# Altium schematic sheet Power.SchDoc
size A4; CheckedBy: Sr. Andrés Roldán; Address1: Avda. Madrid 28, Edif. I+D Josefina Castro Vizoso,  2ª planta 18012 - GRANADA, SPAIN; SheetNumber: 5; SheetTotal: 6
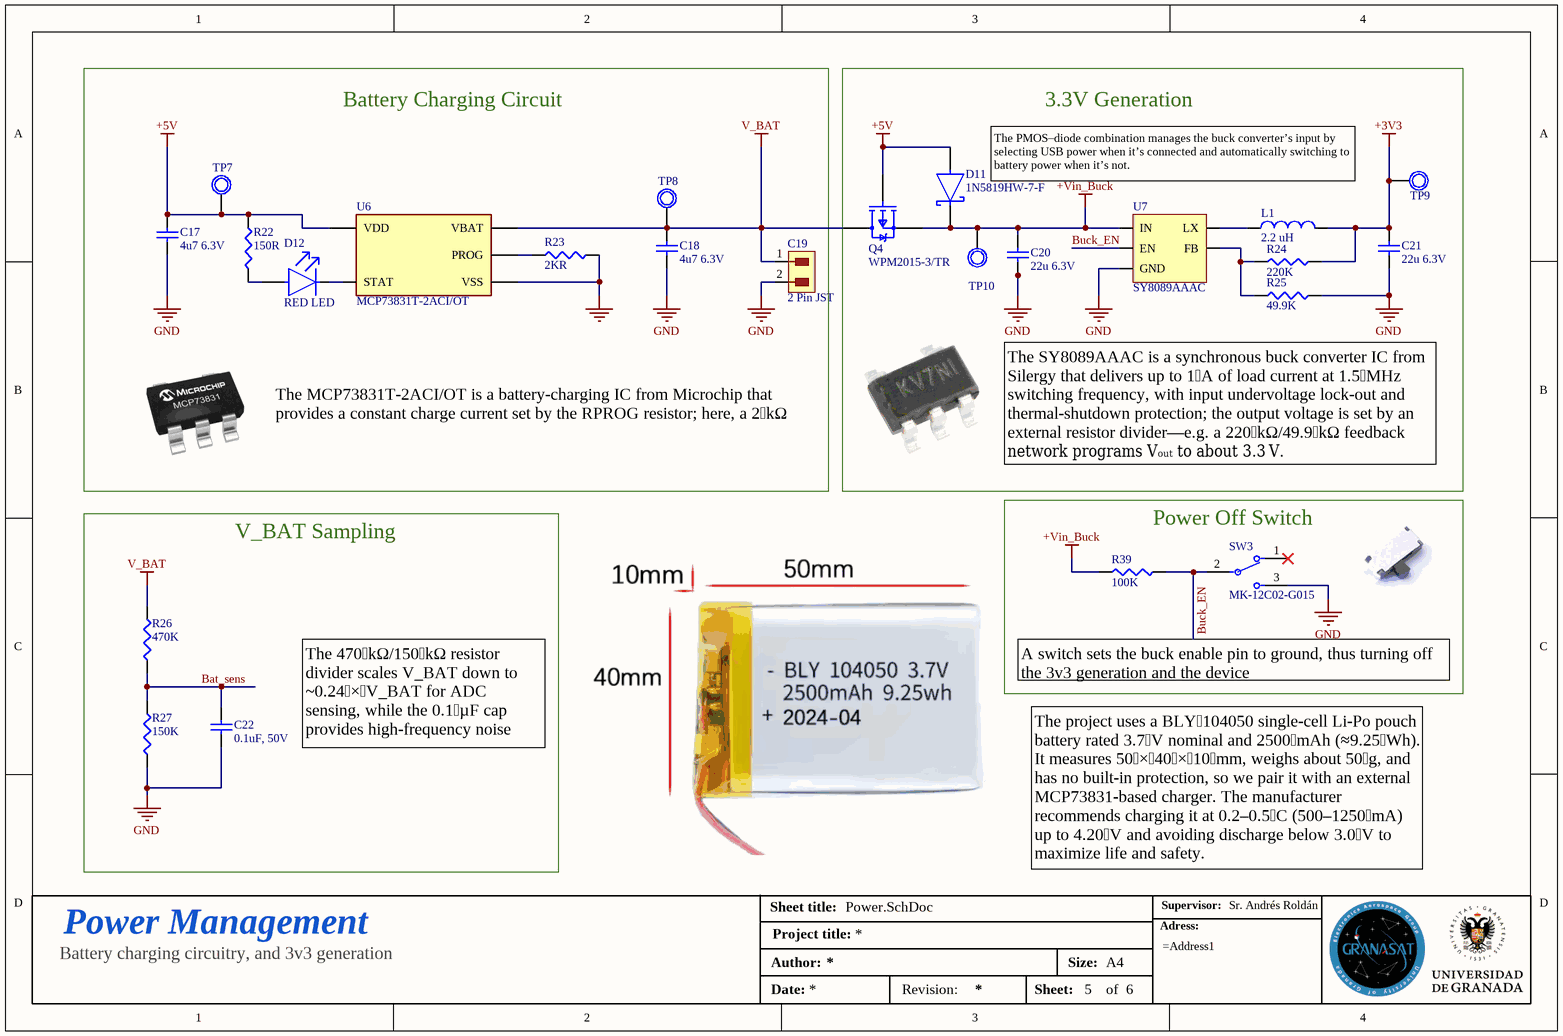
[diagram p0: Power.SchDoc]

## Parts
C17  4u7 6.3V  [CAP 0402_1005]
C18  4u7 6.3V  [CAP 0402_1005]
C19  2 Pin JST  [JST_B2B-PH-K-S]
C20  22u 6.3V  [CAPC1608X90]
C21  22u 6.3V  [CAPC1608X90]
C22  0.1uF, 50V  [CAP 0402_1005]
D11  1N5819HW-7-F  [FP-SOD123-MFG]
D12  RED LED  [FP-LTST-C171KGKT-MFG]
L1  2.2 uH  [IND_VLS3015ET-220M-CA]
Q4  WPM2015-3/TR  [SOT-23]
R22  150R  [RESC1005X37N]
R23  2KR  [RESC1005X37N]
R24  220K  [RESC1005X37N]
R25  49.9K  [RESC1005X37N]
R26  470K  [RESC1005X37N]
R27  150K  [RESC1005X37N]
R39  100K  [RESC1005X37N]
SW3  MK-12C02-G015  [Switch]
TP7  Testpoint  [Testpoint]  (value not drawn)  (no BOM)
TP8  Testpoint  [Testpoint]  (value not drawn)  (no BOM)
TP9  Testpoint  [Testpoint]  (value not drawn)  (no BOM)
TP10  Testpoint  [Testpoint]  (value not drawn)  (no BOM)
U6  MCP73831T-2ACI/OT  [FP-C04-091-OT-IPC_B]
U7  SY8089AAAC  [SOT95P285X140-5N]

## Blocks framed on the sheet
Battery Charging Circuit: C17-C19 D12 R22 R23 TP7 TP8 U6
3.3V Generation: C20 C21 D11 L1 Q4 R24 R25 TP9 TP10 U7
V_BAT Sampling: C22 R26 R27
Power Off Switch: R39 SW3

## Nets
+3V3: C21.2 L1.2 R24.2 TP9.1
+5V: C17.2 D11.2(A) Q4.1(G) R22.2 TP7.1 U6.4(VDD)
+Vin_Buck: C20.2 D11.1(C) Q4.2(S) R39.1 TP10.1 U7.4(IN)
GND: C17.1 C18.1 C19.2 C20.1 C21.1 C22.1 R23.2 R25.2 R27.2 SW3.3 U6.2(VSS) U7.2(GND)
V_BAT: C18.2 C19.1 Q4.3(D) R26.2 TP8.1 U6.3(VBAT)
Bat_sens: C22.2 R26.1 R27.1
Buck_EN: R39.2 SW3.2(C) U7.1(EN)
NetD12_1: D12.1(C) U6.1(STAT)
NetD12_2: D12.2(A) R22.1
NetL1_1: L1.1 U7.3(LX)
NetR23_1: R23.1 U6.5(PROG)
NetR24_1: R24.1 R25.1 U7.5(FB)

Not connected (* = marked no-connect by the designer): SW3 1*

## Notes on the sheet
- The PMOS–diode combination manages the buck converter’s input by selecting USB power when it’s connected and automatically switching to battery power when it’s not.
- The MCP73831T‑2ACI/OT is a battery‑charging IC from Microchip that provides a constant charge current set by the RPROG resistor; here, a 2 kΩ resistor programs the charging current to 500 mA.
- The SY8089AAAC is a synchronous buck converter IC from Silergy that delivers up to 1 A of load current at 1.5 MHz switching frequency, with input undervoltage lock‑out and thermal‑shutdown protection; the output voltage is set by an external resistor divider—e.g. a 220 kΩ/49.9 kΩ feedback network programs Vₒᵤₜ to about 3.3 V.
- A switch sets the buck enable pin to ground, thus turning off the 3v3 generation and the device
- The 470 kΩ/150 kΩ resistor divider scales V_BAT down to ~0.24 × V_BAT for ADC sensing, while the 0.1 µF cap provides high‑frequency noise filtering.
- Sheet title:
- The project uses a BLY 104050 single‑cell Li‑Po pouch battery rated 3.7 V nominal and 2500 mAh (≈9.25 Wh). It measures 50 × 40 × 10 mm, weighs about 50 g, and has no built‑in protection, so we pair it with an external MCP73831‑based charger. The manufacturer recommends charging it at 0.2–0.5 C (500–1250 mA) up to 4.20 V and avoiding discharge below 3.0 V to maximize life and safety.
- Supervisor:
- Power Management
- Author:
- Project title:
- Size:
- A4
- Adress:
- Battery charging circuitry, and 3v3 generation
- Date:
- Revision:
- Sheet:
- of

## Library data of the parts
C17 C18 = CL05A475KQ5NRNC: CAP CER 4.7UF 6.3V X5R 0402; Manufacturer: Samsung; Dielectric Material: Ceramic; Multilayer: Yes; Tolerance  (fill in as +-): 10%; Supplier: Digikey; Supplier Part Number: 1276-1481-1-ND; Manufacturer Part Number: CL05A475KQ5NRNC; RoHS: Yes; Category: Ceramic Capacitors; Stock: 1369367; Pricing: 1=0,08, 10=0,023, 100=0,016, 1000=0,0112, 2500=0,0096 (USD); Mounting Technology: Surface Mount; Pins: 2; Package Shape: Rectangular; Case/Package: 0402; Terminal Finish: Nickel; Min Operating Temperature: -55°C; Max Operating Temperature: 85°C; JESD-609 Code: e3; Value: 4.7uF; Capacitor Type: Ceramic; Packaging: Tape and Reel; Tolerance (fill in as +-): 10%; Rated DC Voltage (URdc): 6.3V; Temperature Characteristics Code: X5R; Termination: Wraparound; Reach SVHC Compliant: Yes; RoHS Compliant: Yes; ComponentLink1URL: https://datasheet.ciiva.com:443/pdfs/VipMasterIC/IC/SEMS/SEMS-S-A0008521219/SEMS-S-A0008521124-1.pdf?src-supplier=IHS+Markit; ComponentLink1Description: https://datasheet.ciiva.com:443/pdfs/VipMasterIC/IC/SEMS/SEMS-S-A0008521219/SEMS-S-A0008521124-1.pdf?src-supplier=IHS+Markit; ComponentLink2URL: https://datasheet.ciiva.com/25793/cl05a475kq5nrnc-25793634.pdf?src-supplier=Digikey; ComponentLink2Description: https://datasheet.ciiva.com/25793/cl05a475kq5nrnc-25793634.pdf?src-supplier=Digikey; LCSC Part Number: C2932473
C19 = B2B-PH-K-S(LF)(SN): Board Connector, 2 Contact(s), 1 Row(s), Male, Straight, 0.079 inch Pitch, Solder Terminal, Locking, Natural Insulator; Supplier: Farnell; Supplier Part Number: 9491856; Manufacturer: JST; Manufacturer Part Number: B2B-PH-K-S(LF)(SN); RoHS: Yes; Category: Headers and Wire Housings; Stock: 746862; Pricing: 100=0,0919, 1000=0,0724, 2500=0,0686, 5000=0,0647, 10000=0,0615, 20000=0,0603 (EUR); ComponentLink1URL: https://datasheet.ciiva.com:443/pdfs/VipMasterIC/IC/JSTM/JSTM-S-A0007943211/JSTM-S-A0007943211-1.pdf?src-supplier=IHS+Markit; ComponentLink1Description: https://datasheet.ciiva.com:443/pdfs/VipMasterIC/IC/JSTM/JSTM-S-A0007943211/JSTM-S-A0007943211-1.pdf?src-supplier=IHS+Markit; ComponentLink2URL: https://datasheet.ciiva.com/11746/0900766b8082f551-11746676.pdf?src-supplier=Rs; ComponentLink2Description: https://datasheet.ciiva.com/11746/0900766b8082f551-11746676.pdf?src-supplier=Rs; ComponentLink3URL: https://datasheet.ciiva.com/16422/b2b-ph-k-slfsn-16422715.pdf?src-supplier=Future+Electronics; ComponentLink3Description: https://datasheet.ciiva.com/16422/b2b-ph-k-slfsn-16422715.pdf?src-supplier=Future+Electronics; LCSC Part Number: C131337
C20 C21 = CL10A226MQ8NRNC: CAP CER 22UF 6.3V X5R 0603; Manufacturer: Samsung; Dielectric Material: Ceramic; Multilayer: Yes; Tolerance  (fill in as +-): 20%; Supplier: Digikey; Supplier Part Number: 1276-1193-1-ND; Manufacturer Part Number: CL10A226MQ8NRNC; RoHS: Yes; Category: Ceramic Capacitors; Stock: 1672290; Pricing: 1=0,22, 10=0,126, 50=0,0812, 100=0,0551, 500=0,0515, 1000=0,04061 (USD); Mounting Technology: Surface Mount; Pins: 2; Package Shape: Rectangular; Case/Package: 0603; Terminal Finish: Nickel; Min Operating Temperature: -55°C; Max Operating Temperature: 85°C; Termination: Wraparound; JESD-609 Code: e3; Value: 22uF; Capacitor Type: Ceramic; Package Style: SMTMeter; Packaging: Tape and Reel; Tolerance (fill in as +-): 20%; Rated DC Voltage (URdc): 6.3V; Temperature Characteristics Code: X5R; Length: 1.6mm; Width: 0.8mm; Height: 1mm; Reach SVHC Compliant: Yes; RoHS Compliant: Yes; ComponentLink1URL: https://datasheet.ciiva.com:443/pdfs/VipMasterIC/IC/SEMS/SEMS-S-A0008525088/SEMS-S-A0008525204-1.pdf?src-supplier=IHS+Markit; ComponentLink1Description: https://datasheet.ciiva.com:443/pdfs/VipMasterIC/IC/SEMS/SEMS-S-A0008525088/SEMS-S-A0008525204-1.pdf?src-supplier=IHS+Markit; ComponentLink2URL: https://datasheet.ciiva.com/25790/cl10a226mq8nrnc-25790695.pdf?src-supplier=Digikey; ComponentLink2Description: https://datasheet.ciiva.com/25790/cl10a226mq8nrnc-25790695.pdf?src-supplier=Digikey; ComponentLink3URL: https://datasheet.ciiva.com/26838/getdatasheetpartid-353311-26838372.pdf?src-supplier=Verical; ComponentLink3Description: https://datasheet.ciiva.com/26838/getdatasheetpartid-353311-26838372.pdf?src-supplier=Verical; ComponentLink4URL: https://datasheet.ciiva.com/29198/457121-da-01-en-vs-kondensator-0603-29198747.pdf?src-supplier=Conrad; ComponentLink4Description: https://datasheet.ciiva.com/29198/457121-da-01-en-vs-kondensator-0603-29198747.pdf?src-supplier=Conrad; ComponentLink5URL: https://datasheet.ciiva.com/16437/cl05b104kq5nnnc-16437317.pdf?src-supplier=Future+Electronics; ComponentLink5Description: https://datasheet.ciiva.com/16437/cl05b104kq5nnnc-16437317.pdf?src-supplier=Future+Electronics; LCSC Part Number: C59461
C22 = CL05B104KB5NNNC: CAP CER 0.1UF 50V X7R 0402; Manufacturer: Samsung; Dielectric Material: Ceramic; Value: 100nF; Multilayer: Yes; Tolerance  (fill in as +-): 10%; Supplier: Avnet; Supplier Part Number: CL05B104KB5NNNC; Manufacturer Part Number: CL05B104KB5NNNC; RoHS: Yes; Category: Ceramic Capacitors; Pricing: 100000=0,00598, 120000=0,00595, 220000=0,00592, 500000=0,00589, 1000000=0,00586 (USD); Mounting Technology: Surface Mount; Pins: 2; Package Shape: Rectangular; Case/Package: 0402; Terminal Finish: Nickel; Min Operating Temperature: -55°C; Max Operating Temperature: 125°C; JESD-609 Code: e3; Capacitor Type: Ceramic; Packaging: Tape and Reel; Tolerance (fill in as +-): 10%; Rated DC Voltage (URdc): 50V; Temperature Characteristics Code: X7R; Termination: Wraparound; Reach SVHC Compliant: Yes; RoHS Compliant: Yes; ComponentLink1URL: https://datasheet.ciiva.com:443/pdfs/VipMasterIC/IC/SEMS/SEMS-S-A0008523115/SEMS-S-A0008523176-1.pdf?src-supplier=IHS+Markit; ComponentLink1Description: https://datasheet.ciiva.com:443/pdfs/VipMasterIC/IC/SEMS/SEMS-S-A0008523115/SEMS-S-A0008523176-1.pdf?src-supplier=IHS+Markit; ComponentLink2URL: https://datasheet.octopart.com/CL05B104KB5NNNC-Samsung-datasheet-97040617.pdf?src-supplier=Future+Electronics; ComponentLink2Description: https://datasheet.octopart.com/CL05B104KB5NNNC-Samsung-datasheet-97040617.pdf?src-supplier=Future+Electronics; ComponentLink3URL: https://datasheet.octopart.com/CL05B104KB5NNNC-Samsung-datasheet-8326407.pdf?src-supplier=TME; ComponentLink3Description: https://datasheet.octopart.com/CL05B104KB5NNNC-Samsung-datasheet-8326407.pdf?src-supplier=TME; LCSC Part Number: C960916
D11 = 1N5819HW-7-F: DIODE SCHOTTKY 40V 1A SOD123; Manufacturer: Diodes; Diode Element Material: SILICON; Package Body Material: Plastic; Diode Type: RECTIFIER; Number of Elements: 1; Max Power Dissipation: 450mW; Forward Voltage: 320mV; Non-rep Pk Forward Current-Max: 25A; Time @ Peak Reflow Temperature-Max (s): 40s; Qualification Status: Not Qualified; Supplier: Digikey; Supplier Part Number: 1N5819HW-FDICT-ND; Manufacturer Part Number: 1N5819HW-7-F; RoHS: Yes; Category: Schottky Diodes; Stock: 462387; Pricing: 1=0,25, 10=0,17, 100=0,1207, 500=0,10056, 1000=0,09006 (USD); Pins: 2; Package Shape: Rectangular; Terminal Finish: Tin; Min Operating Temperature: -65°C; Max Operating Temperature: 125°C; JESD-30 Code: R-PDSO-G2; Max Output current: 1A; Package Style: SMALL OUTLINEMeter; Rep Pk Reverse Voltage-Max: 40V; Surface Mount: Yes; Technology: SCHOTTKY; Terminal Form: Gull Wing; Terminal Position: DUAL; JESD-609 Code: e3; Moisture Sensitivity Level: 1; Peak Reflow Temperature (Cel): 260°C; Reach SVHC Compliant: Yes; RoHS Compliant: Yes; ComponentLink1URL: https://datasheet.ciiva.com:443/pdfs/VipMasterIC/IC/DIOD/DIOD-S-A0009689747/DIOD-S-A0009691035-1.pdf?src-supplier=IHS+Markit; ComponentLink1Description: https://datasheet.ciiva.com:443/pdfs/VipMasterIC/IC/DIOD/DIOD-S-A0009689747/DIOD-S-A0009691035-1.pdf?src-supplier=IHS+Markit; ComponentLink2URL: https://datasheet.ciiva.com/27092/1538419-27092484.pdf?src-supplier=Jameco; ComponentLink2Description: https://datasheet.ciiva.com/27092/1538419-27092484.pdf?src-supplier=Jameco; ComponentLink3URL: https://datasheet.ciiva.com/16303/ds30217-16303296.pdf?src-supplier=Future+Electronics; ComponentLink3Description: https://datasheet.ciiva.com/16303/ds30217-16303296.pdf?src-supplier=Future+Electronics; ComponentLink4URL: https://datasheet.ciiva.com/1177/ds30217-1177089.pdf?src-supplier=Element14; ComponentLink4Description: https://datasheet.ciiva.com/1177/ds30217-1177089.pdf?src-supplier=Element14; ComponentLink5URL: https://datasheet.ciiva.com/8303/ds30217-8303132.pdf?src-supplier=Avnet; ComponentLink5Description: https://datasheet.ciiva.com/8303/ds30217-8303132.pdf?src-supplier=Avnet; ComponentLink6URL: https://datasheet.ciiva.com/912/ds30217-912802.pdf?src-supplier=Digikey; ComponentLink6Description: https://datasheet.ciiva.com/912/ds30217-912802.pdf?src-supplier=Digikey; ComponentLink7URL: https://datasheet.ciiva.com/912/ds30217-912803.pdf?src-supplier=Digikey; ComponentLink7Description: https://datasheet.ciiva.com/912/ds30217-912803.pdf?src-supplier=Digikey; ComponentLink8URL: https://datasheet.ciiva.com/912/ds30217-912801.pdf?src-supplier=Digikey; ComponentLink8Description: https://datasheet.ciiva.com/912/ds30217-912801.pdf?src-supplier=Digikey; LCSC Part Number: C82544
D12 = LTST-C171KGKT: LED RED CLEAR SMD; Manufacturer: Vishay Lite-On; Color: Green; Shape: Rectangular; Lens Style: WATER CLEAR; Forward Current: 30mA; Luminous Intensity-Nom: 35mcd; Channels: 1; Optoelectronic Device Type: SINGLE COLOR LED; Viewing Angle: 130°; Overall Height: 0.8mm; Supplier: Digikey; Supplier Part Number: 160-1426-6-ND; Manufacturer Part Number: LTST-C171KGKT; RoHS: Yes; Category: LEDs; Stock: 28500; Pricing: 1=0,15, 10=0,105, 100=0,0723, 500=0,05736, 1000=0,05238 (USD); Mounting Technology: Surface Mount; Pins: 2; Terminal Finish: Tin; Min Operating Temperature: -55°C; Max Operating Temperature: 85°C; Packaging: Tape and Reel; JESD-609 Code: e3; Size: 1.4mm; Terminal Pitch: 2.5mm; Reach SVHC Compliant: Yes; RoHS Compliant: Yes; ComponentLink1URL: https://datasheet.ciiva.com:443/pdfs/VipMasterIC/IC/LITE/LITES11816/LITES11816-1.pdf?src-supplier=IHS+Markit; ComponentLink1Description: https://datasheet.ciiva.com:443/pdfs/VipMasterIC/IC/LITE/LITES11816/LITES11816-1.pdf?src-supplier=IHS+Markit; ComponentLink2URL: https://datasheet.ciiva.com/11774/0900766b80dc0298-11774377.pdf?src-supplier=Rs; ComponentLink2Description: https://datasheet.ciiva.com/11774/0900766b80dc0298-11774377.pdf?src-supplier=Rs; ComponentLink3URL: https://datasheet.ciiva.com/2110/s-110-ltst-c171kgkt-2110073.pdf?src-supplier=Digikey; ComponentLink3Description: https://datasheet.ciiva.com/2110/s-110-ltst-c171kgkt-2110073.pdf?src-supplier=Digikey; ComponentLink4URL: https://datasheet.ciiva.com/2110/s-110-ltst-c171kgkt-2110072.pdf?src-supplier=Digikey; ComponentLink4Description: https://datasheet.ciiva.com/2110/s-110-ltst-c171kgkt-2110072.pdf?src-supplier=Digikey; ComponentLink5URL: https://datasheet.ciiva.com/2110/s-110-ltst-c171kgkt-2110074.pdf?src-supplier=Digikey; ComponentLink5Description: https://datasheet.ciiva.com/2110/s-110-ltst-c171kgkt-2110074.pdf?src-supplier=Digikey; LCSC Part Number: C284871
L1 = VLS3015ET-2R2M: 1.35A 2.2uH ±20% 1.35A SMD,3x3mm Power Inductors ROHS; Manufacturer: TDK; DC Resistance (DCR): 84mR; Inductor Type: GENERAL PURPOSE INDUCTOR; Max Current Rating: 1.75A; Shielding: Shielded; Channels: 1; Shape/Size Description: RECTANGULAR PACKAGE; Test Frequency: 1MHz; Package Height: 1.5mm; Package Length: 3mm; Supplier: Digikey; Supplier Part Number: 445-6675-1-ND; Manufacturer Part Number: VLS3015ET-2R2M; RoHS: Yes; Category: Fixed Inductors; Stock: 23527; Pricing: 1=0,26, 10=0,214, 100=0,1759, 1000=0,14461, 2000=0,13908, 4000=0,13114, 6000=0,12671, 10000=0,12135, 14000=0,11795, 20000=0,11444, 50000=0,10593 (USD); Pins: 2; Min Operating Temperature: -40°C; Max Operating Temperature: 105°C; Tolerance: 20%; Construction: Magnetic Shielded; Inductance-Nom (L): 2.2uH; Package Style: SMTMeter; Packaging: Tape and Reel; Inductor Application: POWER INDUCTOR; Surface Mount: Yes; Terminal Placement: Dual Ended; Termination: One Surface; Package Width: 3mm; Reach SVHC Compliant: Yes; RoHS Compliant: Yes; ComponentLink1URL: https://datasheet.ciiva.com:443/pdfs/VipMasterIC/IC/TDKC/TDKC-S-A0004908400/TDKC-S-A0004908400-1.pdf?src-supplier=IHS+Markit; ComponentLink1Description: https://datasheet.ciiva.com:443/pdfs/VipMasterIC/IC/TDKC/TDKC-S-A0004908400/TDKC-S-A0004908400-1.pdf?src-supplier=IHS+Markit; ComponentLink2URL: https://datasheet.ciiva.com/28425/1760475-28425754.pdf?src-supplier=Element14; ComponentLink2Description: https://datasheet.ciiva.com/28425/1760475-28425754.pdf?src-supplier=Element14; LCSC Part Number: C76864
Q4 = WPM2015-3/TR: 20V 2.4A 110mΩ@4.5V,2.7A 1.1W 1V@250uA 1 P-Channel SOT-23-3 MOSFETs ROHS; LCSC Part Number: C6562215
R22 = AC0402FR-07150RL: RES SMD 150 OHM 1% 1/16W 0402; Manufacturer: Yageo; Additional Feature: LASER TRIMMABLE; Power: 62.5mW; Rated Temperature: 70°C; Working Voltage: 50V; Temperature Coefficient (ppm/Cel): 100; Package Height: 0.32mm; Package Length: 1mm; Package Width: 0.5mm; Reference Standard: AEC-Q200; Supplier: Digikey; Supplier Part Number: YAG3443DKR-ND; Manufacturer Part Number: AC0402FR-07150RL; Category: Chip SMD Resistors; Stock: 72156; Pricing: 1=0,1, 10=0,009, 100=0,0071, 1000=0,00612, 2500=0,0051, 5000=0,00407 (USD); Mounting Technology: Surface Mount; Pins: 2; Package Shape: Rectangular; Case/Package: 0402; Terminal Finish: Nickel; Min Operating Temperature: -55°C; Max Operating Temperature: 155°C; Tolerance: 1%; JESD-609 Code: e3; Resistor Type: FIXED RESISTOR; Construction: Chip; Packaging: Tape and Reel; Value: 150R; Technology: METAL GLAZE/THICK FILM; Termination: Wraparound; Reach SVHC Compliant: Yes; RoHS Compliant: Yes; ComponentLink1URL: https://datasheet.ciiva.com:443/pdfs/VipMasterIC/IC/YAGO/YAGO-S-A0003597364/YAGO-S-A0003597364-1.pdf?src-supplier=IHS+Markit; ComponentLink1Description: https://datasheet.ciiva.com:443/pdfs/VipMasterIC/IC/YAGO/YAGO-S-A0003597364/YAGO-S-A0003597364-1.pdf?src-supplier=IHS+Markit; ComponentLink2URL: https://datasheet.ciiva.com/12576/pyu-ac-51-rohs-l-2-12576540.pdf?src-supplier=Mouser; ComponentLink2Description: https://datasheet.ciiva.com/12576/pyu-ac-51-rohs-l-2-12576540.pdf?src-supplier=Mouser; ComponentLink3URL: https://datasheet.octopart.com/AC0402FR-07150RL-Yageo-datasheet-83209224.pdf?src-supplier=Upverter; ComponentLink3Description: https://datasheet.octopart.com/AC0402FR-07150RL-Yageo-datasheet-83209224.pdf?src-supplier=Upverter; ComponentLink4URL: https://datasheet.octopart.com/AC0402FR-07150RL-Yageo-datasheet-178509465.pdf?src-supplier=Farnell; ComponentLink4Description: https://datasheet.octopart.com/AC0402FR-07150RL-Yageo-datasheet-178509465.pdf?src-supplier=Farnell; ComponentLink5URL: https://datasheet.octopart.com/AC0402FR-07150RL-Yageo-datasheet-12512238.pdf; ComponentLink5Description: https://datasheet.octopart.com/AC0402FR-07150RL-Yageo-datasheet-12512238.pdf; ComponentLink6URL: https://datasheet.octopart.com/AC0402FR-07150RL-Yageo-datasheet-166720450.pdf?src-supplier=Future+Electronics; ComponentLink6Description: https://datasheet.octopart.com/AC0402FR-07150RL-Yageo-datasheet-166720450.pdf?src-supplier=Future+Electronics; ComponentLink7URL: https://datasheet.octopart.com/AC0402FR-07150RL-Yageo-datasheet-151884373.pdf?src-supplier=Future+Electronics; ComponentLink7Description: https://datasheet.octopart.com/AC0402FR-07150RL-Yageo-datasheet-151884373.pdf?src-supplier=Future+Electronics; ComponentLink8URL: https://datasheet.octopart.com/AC0402FR-07150RL-Yageo-datasheet-137699919.pdf?src-supplier=Future+Electronics; ComponentLink8Description: https://datasheet.octopart.com/AC0402FR-07150RL-Yageo-datasheet-137699919.pdf?src-supplier=Future+Electronics; ComponentLink9URL: https://datasheet.octopart.com/AC0402FR-07150RL-Yageo-datasheet-24580492.pdf?src-supplier=Future+Electronics; ComponentLink9Description: https://datasheet.octopart.com/AC0402FR-07150RL-Yageo-datasheet-24580492.pdf?src-supplier=Future+Electronics; ComponentLink10URL: https://datasheet.octopart.com/AC0402FR-07150RL-Yageo-datasheet-13029202.pdf?src-supplier=Future+Electronics; ComponentLink10Description: https://datasheet.octopart.com/AC0402FR-07150RL-Yageo-datasheet-13029202.pdf?src-supplier=Future+Electronics; ComponentLink11URL: https://datasheet.octopart.com/AC0402FR-07150RL-Yageo-datasheet-140571090.pdf?src-supplier=Arrow.cn; ComponentLink11Description: https://datasheet.octopart.com/AC0402FR-07150RL-Yageo-datasheet-140571090.pdf?src-supplier=Arrow.cn; LCSC Part Number: C226790
R23 = AC0402FR-132KL: RES 2K OHM 1% 1/16W 0402; Manufacturer: Yageo; Supplier: Digikey; Supplier Part Number: 13-AC0402FR-132KLDKR-ND; Manufacturer Part Number: AC0402FR-132KL; RoHS: Yes; Category: Chip SMD Resistors; Stock: 81716; Pricing: 1=0,1, 10=0,023, 100=0,0107, 1000=0,00577, 2500=0,00469, 5000=0,00407, 10000=0,00358 (USD); LCSC Part Number: C144770
R24 = RC0402JR-07220KL: RES 220K OHM 5% 1/16W 0402; Manufacturer: Yageo; Additional Feature: LASER TRIMMABLE; Power: 62.5mW; Rated Temperature: 70°C; Value: 220kR; Working Voltage: 50V; Temperature Coefficient (ppm/Cel): 100; Package Height: 0.35mm; Package Length: 1mm; Package Width: 0.5mm; Supplier: Digikey; Supplier Part Number: 311-220KJRCT-ND; Manufacturer Part Number: RC0402JR-07220KL; RoHS: Yes; Category: Chip SMD Resistors; Stock: 461341; Pricing: 1=0,1, 10=0,007, 50=0,0066, 100=0,0061, 500=0,0056, 1000=0,0051, 5000=0,00408 (USD); Mounting Technology: Surface Mount; Pins: 2; Package Shape: Rectangular; Case/Package: 0402; Terminal Finish: Nickel; Min Operating Temperature: -55°C; Max Operating Temperature: 155°C; Tolerance: 5%; JESD-609 Code: e3; Resistor Type: FIXED RESISTOR; Construction: Chip; Packaging: Tape and Reel; Technology: METAL GLAZE/THICK FILM; Termination: Wraparound; Reach SVHC Compliant: Yes; RoHS Compliant: Yes; ComponentLink1URL: https://datasheet.ciiva.com:443/pdfs/VipMasterIC/IC/YAGO/YAGO-S-A0008145938/YAGO-S-A0008145938-1.pdf?src-supplier=IHS+Markit; ComponentLink1Description: https://datasheet.ciiva.com:443/pdfs/VipMasterIC/IC/YAGO/YAGO-S-A0008145938/YAGO-S-A0008145938-1.pdf?src-supplier=IHS+Markit; ComponentLink2URL: https://datasheet.ciiva.com/7983/1018594-7983565.pdf?src-supplier=Element14; ComponentLink2Description: https://datasheet.ciiva.com/7983/1018594-7983565.pdf?src-supplier=Element14; ComponentLink3URL: https://datasheet.ciiva.com/12558/pyu-rc0402-51-rohs-l-6-r-8721-12558319.pdf?src-supplier=Mouser; ComponentLink3Description: https://datasheet.ciiva.com/12558/pyu-rc0402-51-rohs-l-6-r-8721-12558319.pdf?src-supplier=Mouser; ComponentLink4URL: https://datasheet.ciiva.com/7850/1018594-7850175.pdf?src-supplier=Element14; ComponentLink4Description: https://datasheet.ciiva.com/7850/1018594-7850175.pdf?src-supplier=Element14; ComponentLink5URL: https://datasheet.ciiva.com/7850/1018594-7850174.pdf?src-supplier=Element14; ComponentLink5Description: https://datasheet.ciiva.com/7850/1018594-7850174.pdf?src-supplier=Element14; ComponentLink6URL: https://datasheet.ciiva.com/17067/pyu-rc0402-51-rohs-l-6-r-17067375.pdf?src-supplier=Future+Electronics; ComponentLink6Description: https://datasheet.ciiva.com/17067/pyu-rc0402-51-rohs-l-6-r-17067375.pdf?src-supplier=Future+Electronics; LCSC Part Number: C137900
R25 = RC0402FR-0749K9L: RES 49.9K OHM 1% 1/16W 0402; Manufacturer: Yageo; Additional Feature: LASER TRIMMABLE; Power: 62.5mW; Rated Temperature: 70°C; Value: 49.9kR; Working Voltage: 50V; Temperature Coefficient (ppm/Cel): 100; Package Height: 0.35mm; Package Length: 1mm; Package Width: 0.5mm; Supplier: Digikey; Supplier Part Number: 311-49.9KLRCT-ND; Manufacturer Part Number: RC0402FR-0749K9L; RoHS: Yes; Category: Chip SMD Resistors; Stock: 2577197; Pricing: 1=0,1, 10=0,009, 100=0,0061, 1000=0,00408, 2500=0,00328 (USD); Mounting Technology: Surface Mount; Pins: 2; Package Shape: Rectangular; Case/Package: 0402; Terminal Finish: Nickel; Min Operating Temperature: -55°C; Max Operating Temperature: 155°C; Tolerance: 1%; JESD-609 Code: e3; Resistor Type: FIXED RESISTOR; Construction: Chip; Packaging: Tape and Reel; Technology: METAL GLAZE/THICK FILM; Termination: Wraparound; Reach SVHC Compliant: Yes; RoHS Compliant: Yes; ComponentLink1URL: https://datasheet.ciiva.com:443/pdfs/VipMasterIC/IC/YAGO/YAGO-S-A0008145938/YAGO-S-A0008145938-1.pdf?src-supplier=IHS+Markit; ComponentLink1Description: https://datasheet.ciiva.com:443/pdfs/VipMasterIC/IC/YAGO/YAGO-S-A0008145938/YAGO-S-A0008145938-1.pdf?src-supplier=IHS+Markit; ComponentLink2URL: https://datasheet.ciiva.com/17071/pyu-rc0402-51-rohs-l-6-r-17071066.pdf?src-supplier=Future+Electronics; ComponentLink2Description: https://datasheet.ciiva.com/17071/pyu-rc0402-51-rohs-l-6-r-17071066.pdf?src-supplier=Future+Electronics; LCSC Part Number: C137969
R26 = RC0402JR-07470KL: RES 470K OHM 5% 1/16W 0402; Manufacturer: Yageo; Additional Feature: LASER TRIMMABLE; Power: 62.5mW; Rated Temperature: 70°C; Value: 470kR; Working Voltage: 50V; Temperature Coefficient (ppm/Cel): 100; Package Height: 0.35mm; Package Length: 1mm; Package Width: 0.5mm; Supplier: Digikey; Supplier Part Number: 311-470KJRDKR-ND; Manufacturer Part Number: RC0402JR-07470KL; RoHS: Yes; Category: Chip SMD Resistors; Stock: 161829; Pricing: 1=0,1, 10=0,006, 50=0,0056, 100=0,0051, 500=0,0046, 1000=0,00408, 5000=0,00284 (USD); Mounting Technology: Surface Mount; Pins: 2; Package Shape: Rectangular; Case/Package: 0402; Terminal Finish: Nickel; Min Operating Temperature: -55°C; Max Operating Temperature: 155°C; Tolerance: 5%; JESD-609 Code: e3; Resistor Type: FIXED RESISTOR; Construction: Chip; Packaging: Tape and Reel; Technology: METAL GLAZE/THICK FILM; Termination: Wraparound; Reach SVHC Compliant: Yes; RoHS Compliant: Yes; ComponentLink1URL: https://datasheet.ciiva.com:443/pdfs/VipMasterIC/IC/YAGO/YAGO-S-A0008145938/YAGO-S-A0008145938-1.pdf?src-supplier=IHS+Markit; ComponentLink1Description: https://datasheet.ciiva.com:443/pdfs/VipMasterIC/IC/YAGO/YAGO-S-A0008145938/YAGO-S-A0008145938-1.pdf?src-supplier=IHS+Markit; ComponentLink2URL: https://datasheet.ciiva.com/2452/pyu-r-int-thick-7-2452630.pdf?src-supplier=Digikey; ComponentLink2Description: https://datasheet.ciiva.com/2452/pyu-r-int-thick-7-2452630.pdf?src-supplier=Digikey; ComponentLink3URL: https://datasheet.ciiva.com/2452/pyu-r-int-thick-7-2452631.pdf?src-supplier=Digikey; ComponentLink3Description: https://datasheet.ciiva.com/2452/pyu-r-int-thick-7-2452631.pdf?src-supplier=Digikey; ComponentLink4URL: https://datasheet.ciiva.com/2452/pyu-r-int-thick-7-2452629.pdf?src-supplier=Digikey; ComponentLink4Description: https://datasheet.ciiva.com/2452/pyu-r-int-thick-7-2452629.pdf?src-supplier=Digikey; ComponentLink5URL: https://datasheet.ciiva.com/12667/pyu-rc0402-51-rohs-l-6-r-12667098.pdf?src-supplier=Mouser; ComponentLink5Description: https://datasheet.ciiva.com/12667/pyu-rc0402-51-rohs-l-6-r-12667098.pdf?src-supplier=Mouser; ComponentLink6URL: https://datasheet.ciiva.com/7850/1018594-7850214.pdf?src-supplier=Element14; ComponentLink6Description: https://datasheet.ciiva.com/7850/1018594-7850214.pdf?src-supplier=Element14; ComponentLink7URL: https://datasheet.ciiva.com/7850/1018594-7850215.pdf?src-supplier=Element14; ComponentLink7Description: https://datasheet.ciiva.com/7850/1018594-7850215.pdf?src-supplier=Element14; LCSC Part Number: C137865
R27 = RC0402JR-07150KL: RES 150K OHM 5% 1/16W 0402; Manufacturer: Yageo; Additional Feature: LASER TRIMMABLE; Power: 62.5mW; Rated Temperature: 70°C; Value: 150kR; Working Voltage: 50V; Temperature Coefficient (ppm/Cel): 100; Package Height: 0.35mm; Package Length: 1mm; Package Width: 0.5mm; Supplier: Digikey; Supplier Part Number: 311-150KJRCT-ND; Manufacturer Part Number: RC0402JR-07150KL; RoHS: Yes; Category: Chip SMD Resistors; Stock: 408329; Pricing: 1=0,1, 10=0,006, 50=0,0052, 100=0,0041, 500=0,00356, 1000=0,00306 (USD); Mounting Technology: Surface Mount; Pins: 2; Package Shape: Rectangular; Case/Package: 0402; Terminal Finish: Nickel; Min Operating Temperature: -55°C; Max Operating Temperature: 155°C; Tolerance: 5%; JESD-609 Code: e3; Resistor Type: FIXED RESISTOR; Construction: Chip; Packaging: Tape and Reel; Technology: METAL GLAZE/THICK FILM; Termination: Wraparound; Reach SVHC Compliant: Yes; RoHS Compliant: Yes; ComponentLink1URL: https://datasheet.ciiva.com:443/pdfs/VipMasterIC/IC/YAGO/YAGO-S-A0008145938/YAGO-S-A0008145938-1.pdf?src-supplier=IHS+Markit; ComponentLink1Description: https://datasheet.ciiva.com:443/pdfs/VipMasterIC/IC/YAGO/YAGO-S-A0008145938/YAGO-S-A0008145938-1.pdf?src-supplier=IHS+Markit; ComponentLink2URL: https://datasheet.ciiva.com/7983/1018594-7983551.pdf?src-supplier=Element14; ComponentLink2Description: https://datasheet.ciiva.com/7983/1018594-7983551.pdf?src-supplier=Element14; ComponentLink3URL: https://datasheet.ciiva.com/2518/pyu-r-int-thick-7-2518929.pdf?src-supplier=Digikey; ComponentLink3Description: https://datasheet.ciiva.com/2518/pyu-r-int-thick-7-2518929.pdf?src-supplier=Digikey; ComponentLink4URL: https://datasheet.ciiva.com/2518/pyu-r-int-thick-7-2518930.pdf?src-supplier=Digikey; ComponentLink4Description: https://datasheet.ciiva.com/2518/pyu-r-int-thick-7-2518930.pdf?src-supplier=Digikey; ComponentLink5URL: https://datasheet.ciiva.com/2518/pyu-r-int-thick-7-2518928.pdf?src-supplier=Digikey; ComponentLink5Description: https://datasheet.ciiva.com/2518/pyu-r-int-thick-7-2518928.pdf?src-supplier=Digikey; ComponentLink6URL: https://datasheet.ciiva.com/7850/1018594-7850149.pdf?src-supplier=Element14; ComponentLink6Description: https://datasheet.ciiva.com/7850/1018594-7850149.pdf?src-supplier=Element14; ComponentLink7URL: https://datasheet.ciiva.com/17072/pyu-rc0402-51-rohs-l-6-r-17072379.pdf?src-supplier=Future+Electronics; ComponentLink7Description: https://datasheet.ciiva.com/17072/pyu-rc0402-51-rohs-l-6-r-17072379.pdf?src-supplier=Future+Electronics; ComponentLink8URL: https://datasheet.ciiva.com/15189/getdatasheetpartid-251830-15189543.pdf?src-supplier=Verical; ComponentLink8Description: https://datasheet.ciiva.com/15189/getdatasheetpartid-251830-15189543.pdf?src-supplier=Verical; LCSC Part Number: C93947
R39 = AC0402FR-07100KL: RES SMD 100K OHM 1% 1/16W 0402; Manufacturer: Yageo; Additional Feature: LASER TRIMMABLE; Power: 62.5mW; Rated Temperature: 70°C; Value: 100kR; Working Voltage: 50V; Temperature Coefficient (ppm/Cel): 100; Package Height: 0.32mm; Package Length: 1mm; Package Width: 0.5mm; Reference Standard: AEC-Q200; Supplier: Digikey; Supplier Part Number: YAG3434CT-ND; Manufacturer Part Number: AC0402FR-07100KL; RoHS: Yes; Category: Chip SMD Resistors; Stock: 553072; Pricing: 1=0,1, 10=0,011, 100=0,0082, 1000=0,00612, 2500=0,0051 (USD); Mounting Technology: Surface Mount; Pins: 2; Package Shape: Rectangular; Case/Package: 0402; Terminal Finish: Nickel; Min Operating Temperature: -55°C; Max Operating Temperature: 155°C; Tolerance: 1%; JESD-609 Code: e3; Resistor Type: FIXED RESISTOR; Construction: Chip; Packaging: Tape and Reel; Technology: METAL GLAZE/THICK FILM; Termination: Wraparound; Reach SVHC Compliant: Yes; RoHS Compliant: Yes; ComponentLink1URL: https://datasheet.ciiva.com:443/pdfs/VipMasterIC/IC/YAGO/YAGO-S-A0003597364/YAGO-S-A0003597364-1.pdf?src-supplier=IHS+Markit; ComponentLink1Description: https://datasheet.ciiva.com:443/pdfs/VipMasterIC/IC/YAGO/YAGO-S-A0003597364/YAGO-S-A0003597364-1.pdf?src-supplier=IHS+Markit; ComponentLink2URL: https://datasheet.octopart.com/AC0402FR-07100KL-Yageo-datasheet-166720450.pdf?src-supplier=Future+Electronics; ComponentLink2Description: https://datasheet.octopart.com/AC0402FR-07100KL-Yageo-datasheet-166720450.pdf?src-supplier=Future+Electronics; ComponentLink3URL: http://www.yageo.com/NewPortal/yageodocoutput?fileName=/pdf/R-Chip/PYu-AC_51_RoHS_L_6.pdf&src-supplier=Digikey; ComponentLink3Description: http://www.yageo.com/NewPortal/yageodocoutput?fileName=/pdf/R-Chip/PYu-AC_51_RoHS_L_6.pdf&src-supplier=Digikey; ComponentLink4URL: http://www.yageo.com/documents/recent/PYu-AC_51_RoHS_L_2.pdf?src-supplier=Mouser; ComponentLink4Description: http://www.yageo.com/documents/recent/PYu-AC_51_RoHS_L_2.pdf?src-supplier=Mouser; ComponentLink5URL: http://www.yageo.com/documents/recent/PYu-AC_51_RoHS_L_2_revised.pdf?src-supplier=Future+Electronics; ComponentLink5Description: http://www.yageo.com/documents/recent/PYu-AC_51_RoHS_L_2_revised.pdf?src-supplier=Future+Electronics; LCSC Part Number: C144809
SW3 = MK-12C02-G015: Surface Mount, Right Angle 1A SPDT 6V Black 10,000 Cycles SMD Slide Switches ROHS; LCSC Part Number: C2911519
U6 = MCP73831T-2ACI/OT: Power Supply Support Circuit, Adjustable, 1 Channel, PDSO5; Manufacturer: Microchip; Package Body Material: Plastic; Adjustable Threshold: Yes; Number of Channels: 1; Package Equivalence Code: TSOP5/6,.11,37; Power Supplies: 3.3/5V; Supply Current-Max (Isup): 1.5mA; Max Supply Voltage: 6V; Min Supply Voltage: 3.75V; Nominal Supply Voltage: 5.2V; Time @ Peak Reflow Temperature-Max (s): 40s; Qualification Status: Not Qualified; Supplier: Farnell; Supplier Part Number: 1332158; Manufacturer Part Number: MCP73831T-2ACI/OT; RoHS: Yes; Category: Battery Management; Stock: 23698; Pricing: 1=0,754, 25=0,625, 100=0,607, 3000=0,595 (EUR); Case/Package: LSSOP; Pins: 5; Package Shape: Rectangular; Terminal Finish: Tin; Min Operating Temperature: -40°C; Max Operating Temperature: 85°C; JESD-609 Code: e3; Throw Configuration: POWER SUPPLY SUPPORT CIRCUIT; JESD-30 Code: R-PDSO-G5; Moisture Sensitivity Level: 1; Channels: 1; Package Style: SMALL OUTLINE, LOW PROFILE, SHRINK PITCHMeter; Peak Reflow Temperature (Cel): 260°C; Surface Mount: Yes; Terminal Form: Gull Wing; Terminal Position: DUAL; Length: 2.95mm; Width: 1.65mm; Height - Seated (Max): 1.45mm; Terminal Pitch: 0.95mm; Reach SVHC Compliant: Yes; RoHS Compliant: Yes; Temperature Grade: INDUSTRIAL; ComponentLink1URL: https://datasheet.ciiva.com:443/pdfs/VipMasterIC/IC/MCHP/MCHPS05673/MCHPS05673-1.pdf?src-supplier=IHS+Markit; ComponentLink1Description: https://datasheet.ciiva.com:443/pdfs/VipMasterIC/IC/MCHP/MCHPS05673/MCHPS05673-1.pdf?src-supplier=IHS+Markit; ComponentLink2URL: https://datasheet.ciiva.com/22828/0900766b80d2b53a-22828876.pdf?src-supplier=Rs; ComponentLink2Description: https://datasheet.ciiva.com/22828/0900766b80d2b53a-22828876.pdf?src-supplier=Rs; ComponentLink3URL: https://datasheet.ciiva.com/26344/651521-da-01-en-contr-mcp73831t-2aci-ot-sot-23-5-mcp-26344458.pdf?src-supplier=Conrad; ComponentLink3Description: https://datasheet.ciiva.com/26344/651521-da-01-en-contr-mcp73831t-2aci-ot-sot-23-5-mcp-26344458.pdf?src-supplier=Conrad; ComponentLink4URL: https://datasheet.ciiva.com/1137/630369-1137803.pdf?src-supplier=Element14; ComponentLink4Description: https://datasheet.ciiva.com/1137/630369-1137803.pdf?src-supplier=Element14; ComponentLink5URL: https://datasheet.ciiva.com/46385/630369-46385324.pdf?src-supplier=Element14; ComponentLink5Description: https://datasheet.ciiva.com/46385/630369-46385324.pdf?src-supplier=Element14; ComponentLink6URL: https://datasheet.ciiva.com/16286/filehandler-aspxddocname-en025112-16286957.pdf?src-supplier=Future+Electronics; ComponentLink6Description: https://datasheet.ciiva.com/16286/filehandler-aspxddocname-en025112-16286957.pdf?src-supplier=Future+Electronics; ComponentLink7URL: https://datasheet.ciiva.com/1931/21984e-1931954.pdf?src-supplier=Digikey; ComponentLink7Description: https://datasheet.ciiva.com/1931/21984e-1931954.pdf?src-supplier=Digikey; ComponentLink8URL: https://datasheet.ciiva.com/1931/21984e-1931955.pdf?src-supplier=Digikey; ComponentLink8Description: https://datasheet.ciiva.com/1931/21984e-1931955.pdf?src-supplier=Digikey; ComponentLink9URL: https://datasheet.ciiva.com/1931/21984e-1931953.pdf?src-supplier=Digikey; ComponentLink9Description: https://datasheet.ciiva.com/1931/21984e-1931953.pdf?src-supplier=Digikey; ComponentLink10URL: https://datasheet.ciiva.com/28626/630369-28626439.pdf?src-supplier=Element14; ComponentLink10Description: https://datasheet.ciiva.com/28626/630369-28626439.pdf?src-supplier=Element14; ComponentLink11URL: https://datasheet.ciiva.com/1144/630369-1144461.pdf?src-supplier=Newark; ComponentLink11Description: https://datasheet.ciiva.com/1144/630369-1144461.pdf?src-supplier=Newark; ComponentLink12URL: https://datasheet.ciiva.com/3213/21984e-3213404.pdf?src-supplier=Avnet; ComponentLink12Description: https://datasheet.ciiva.com/3213/21984e-3213404.pdf?src-supplier=Avnet; LCSC Part Number: C424093
U7 = SY8089AAAC: Buck Adjustable 2A 2.7V~5.5V SOT-23-5 DC-DC Converters ROHS; LCSC Part Number: C78988